# EAGLE design QiCape-v0.1 (EAGLE 6.3)
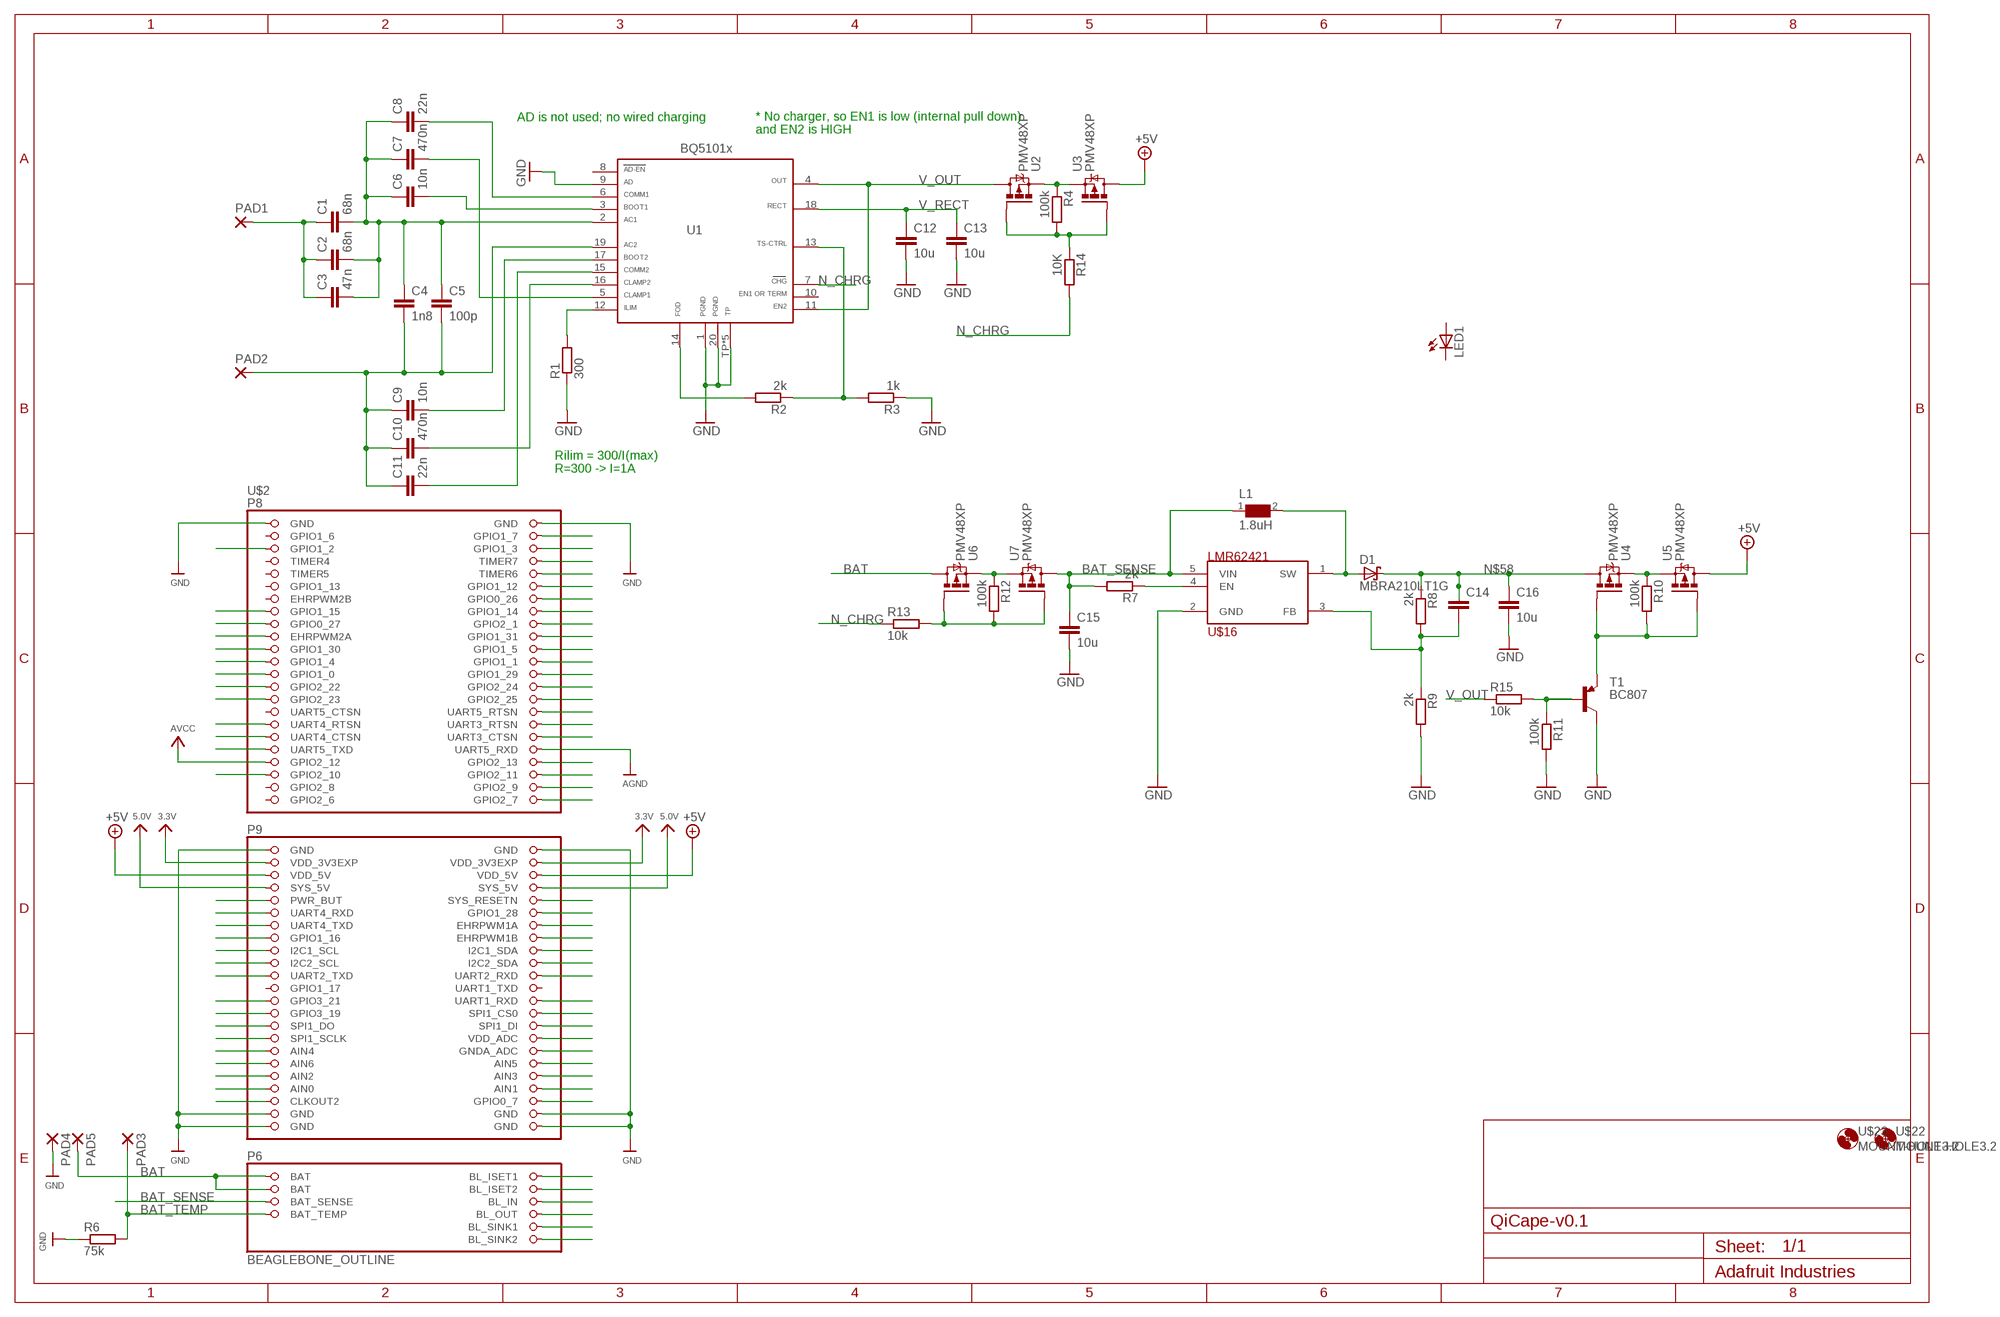
[diagram p0: schematic, sheet 1]

## Parts
C1  68n  C-EUC0603K  [C0603K]
C2  68n  C-EUC0603K  [C0603K]
C3  47n  C-EUC0603K  [C0603K]
C4  1n8  C-EUC0603K  [C0603K]
C5  100p  C-EUC0603K  [C0603K]
C6  10n  C-EUC0603K  [C0603K]
C7  470n  C-EUC0603K  [C0603K]
C8  22n  C-EUC0603K  [C0603K]
C9  10n  C-EUC0603K  [C0603K]
C10  470n  C-EUC0603K  [C0603K]
C11  22n  C-EUC0603K  [C0603K]
C12  10u  C-EUC0805  [C0805]
C13  10u  C-EUC0805  [C0805]
C14  C-EUC0402  [C0402]
C15  10u  C-EUC0805  [C0805]
C16  10u  C-EUC1206  [C1206]
D1  MBRA210LT1G  SCHOTTKY-DIODEMBRA210LT3G  [SMA-DO214AC]
L1  1.8uH  WE-TPC_5818/5828  [WE-TPC_5818/5828]
LED1  LEDCHIP-LED0603  [CHIP-LED0603]
PAD1  1,6/0,8  [1,6/0,8]
PAD2  1,6/0,8  [1,6/0,8]
PAD3  1,6/0,8  [1,6/0,8]
PAD4  1,6/0,8  [1,6/0,8]
PAD5  1,6/0,8  [1,6/0,8]
R1  300  R-EU_R0402  [R0402]
R2  2k  R-EU_R0402  [R0402]
R3  1k  R-EU_R0402  [R0402]
R4  100k  R-EU_R0402  [R0402]
R6  75k  R-EU_R0402  [R0402]
R7  2k  R-EU_R0402  [R0402]
R8  2k  R-EU_R0402  [R0402]
R9  2k  R-EU_R0402  [R0402]
R10  100k  R-EU_R0402  [R0402]
R11  100k  R-EU_R0402  [R0402]
R12  100k  R-EU_R0402  [R0402]
R13  10k  R-EU_R0402  [R0402]
R14  10K  R-EU_R0402  [R0402]
R15  10k  R-EU_R0402  [R0402]
T1  BC807  BC807-16-PNP-SOT23-BEC  [SOT23-BEC]
U1  BQ51013ARHL20  [RHL]
U2  PMV48XP  [SOT95P230X110-3N]
U3  PMV48XP  [SOT95P230X110-3N]
U4  PMV48XP  [SOT95P230X110-3N]
U5  PMV48XP  [SOT95P230X110-3N]
U6  PMV48XP  [SOT95P230X110-3N]
U7  PMV48XP  [SOT95P230X110-3N]
U$2  BEAGLEBONE_OUTLINE  [BEAGLEBONE_SHIELD_VS]
U$16  LMR62421  [SOT23-5]
U$22  MOUNT-HOLE3.2  [3,2]
U$23  MOUNT-HOLE3.2  [3,2]

## Nets
3.3V: U$2.49(VDD_3V3EXP) U$2.50(VDD_3V3EXP)
5.0V: U$2.53(SYS_5V) U$2.54(SYS_5V)
+5V: U3.3(D) U5.3(D) U$2.51(VDD_5V) U$2.52(VDD_5V)
AGND: U$2.38(UART5_RXD)
AVCC: U$2.39(GPIO2_12)
BAT: PAD5.1(P) U6.3(D) U$2.1_BAT(BAT) U$2.2_BAT(BAT)
BAT_SENSE: C15.1 L1.1 R7.2 U7.3(D) U$2.3_BAT_SENSE(BAT_SENSE) U$16.5(VIN)
BAT_TEMP: PAD3.1(P) R6.2 U$2.4_BAT_TEMP(BAT_TEMP)
GND: C12.2 C13.2 C15.2 C16.2 PAD4.1(P) R1.1 R3.1 R6.1 R9.2 R11.2 T1.C U1.1 U1.9 U1.20 U1.TP U1.TP1(TP) U1.TP2(TP) U1.TP3(TP) U1.TP4(TP) U$2.1(GND) U$2.2(GND) U$2.47(GND) U$2.48(GND) U$2.89(GND) U$2.90(GND) U$2.91(GND) U$2.92(GND) U$16.2(GND)
N$1: U$2.6_BL_ISET1(BL_ISET1)
N$2: R4.1 U2.2(S) U3.2(S)
N$3: C1.2 C2.2 C3.2 C4.1 C5.1 C6.1 C7.1 C8.1 U1.2
N$4: C6.2 U1.3
N$5: C7.2 U1.5
N$6: C8.2 U1.6
N$7: C1.1 C2.1 C3.1 PAD1.1(P)
N$8: U$2.15(GPIO1_15)
N$9: U$2.17(GPIO0_27)
N$10: U$2.19(EHRPWM2A)
N$11: U$2.21(GPIO1_30)
N$12: U$2.23(GPIO1_4)
N$13: U$2.25(GPIO1_0)
N$14: U$2.27(GPIO2_22)
N$15: U$2.29(GPIO2_23)
N$16: C4.2 C5.2 C9.1 C10.1 C11.1 PAD2.1(P) U1.19
N$17: U$2.33(UART4_RTSN)
N$18: U$2.35(UART4_CTSN)
N$19: U$2.37(UART5_TXD)
N$20: C9.2 U1.17
N$21: U$2.41(GPIO2_10)
N$22: C11.2 U1.15
N$23: C10.2 U1.16
N$24: R1.2 U1.12
N$25: R10.2 T1.E U4.1(G) U5.1(G)
N$26: R2.2 U1.14
N$27: U$2.8(TIMER7)
N$28: U$2.10(TIMER6)
N$29: U$2.12(GPIO1_12)
N$30: U$2.14(GPIO0_26)
N$31: U$2.16(GPIO1_14)
N$32: U$2.18(GPIO2_1)
N$33: U$2.20(GPIO1_31)
N$34: U$2.22(GPIO1_5)
N$35: U$2.24(GPIO1_1)
N$36: U$2.26(GPIO1_29)
N$37: U$2.28(GPIO2_24)
N$38: U$2.30(GPIO2_25)
N$39: U$2.32(UART5_RTSN)
N$40: U$2.34(UART3_RTSN)
N$41: U$2.36(UART3_CTSN)
N$42: R2.1 R3.2 U1.13
N$43: U$2.40(GPIO2_13)
N$44: U$2.42(GPIO2_11)
N$45: U$2.44(GPIO2_9)
N$46: U$2.46(GPIO2_7)
N$47: C14.2 R8.2 R9.1 U$16.3(FB)
N$48: U$2.5(GPIO1_2)
N$49: R11.1 R15.2 T1.B
N$50: U$2.4(GPIO1_7)
N$51: U$2.55(PWR_BUT)
N$52: U$2.57(UART4_RXD)
N$53: U$2.59(UART4_TXD)
N$54: U$2.61(GPIO1_16)
N$55: U$2.63(I2C1_SCL)
N$56: U$2.65(I2C2_SCL)
N$57: U$2.67(UART2_TXD)
N$58: C14.1 C16.1 D1.K(C) R8.1 U4.3(D)
N$59: U$2.71(GPIO3_21)
N$60: U$2.73(GPIO3_19)
N$61: U$2.75(SPI1_DO)
N$62: U$2.77(SPI1_SCLK)
N$63: U$2.79(AIN4)
N$64: U$2.81(AIN6)
N$65: U$2.83(AIN2)
N$66: U$2.85(AIN0)
N$67: U$2.87(CLKOUT2)
N$68: U$2.6(GPIO1_3)
N$69: U$2.88(GPIO0_7)
N$70: R7.1 U$16.4(EN)
N$71: R10.1 U4.2(S) U5.2(S)
N$72: R12.1 U6.2(S) U7.2(S)
N$73: R4.2 R14.1 U2.1(G) U3.1(G)
N$74: U$2.56(SYS_RESETN)
N$75: U$2.58(GPIO1_28)
N$76: U$2.60(EHRPWM1A)
N$77: U$2.62(EHRPWM1B)
N$78: U$2.64(I2C1_SDA)
N$79: U$2.66(I2C2_SDA)
N$80: U$2.68(UART2_RXD)
N$81: D1.A L1.2 U$16.1(SW)
N$82: U$2.72(UART1_RXD)
N$83: U$2.74(SPI1_CS0)
N$84: U$2.76(SPI1_DI)
N$85: U$2.78(VDD_ADC)
N$86: U$2.80(GNDA_ADC)
N$87: U$2.82(AIN5)
N$88: U$2.84(AIN3)
N$89: U$2.86(AIN1)
N_CHRG: R13.1 R14.2 U1.7
N_CHRG1: R12.2 R13.2 U6.1(G) U7.1(G)
V_OUT: R15.1 U1.4 U1.11 U2.3(D)
V_RECT: C12.1 C13.1 U1.18
Unconnected: LED1.A LED1.C U1.8 U1.10 U$2.5_BL_ISET2(BL_ISET2) U$2.7(TIMER4) U$2.9(TIMER5) U$2.9_BL_SINK1(BL_SINK1) U$2.10_BL_SINK2(BL_SINK2) U$2.11(GPIO1_13) U$2.13(EHRPWM2B) U$2.31(UART5_CTSN) U$2.69(GPIO1_17) U$2.70(UART1_TXD)

## Notes on the sheet
- AD is not used; no wired charging
- * No charger, so EN1 is low (internal pull down)
  and EN2 is HIGH
- Rilim = 300/I(max)
  R=300 -> I=1A

## Power pins joined to a net without a drawn wire
BL_IN: U$2.8_BL_IN(BL_IN)
BL_OUT: U$2.7_BL_OUT(BL_OUT)
GPIO1_6: U$2.3(GPIO1_6)
GPIO2_6: U$2.45(GPIO2_6)
GPIO2_8: U$2.43(GPIO2_8)

## Library data of the parts
C1 C2 = resistor:C-EU: CAPACITOR, European symbol; MF: KEMET; MPN: C0603C682K5RACTU; OC_NEWARK: 70K9097
C3 = resistor:C-EU: CAPACITOR, European symbol; MPN: C0603C473K5RACTU; OC_NEWARK: 53M7213
C4 = resistor:C-EU: CAPACITOR, European symbol; MPN: C0603C182K5RACTU; OC_NEWARK: 29T8997
C5 = resistor:C-EU: CAPACITOR, European symbol; MF: KEMET; MPN: C0603C101K5RACTU; OC_NEWARK: 72J6357
C6 C7 C9 C10 = resistor:C-EU: CAPACITOR, European symbol; OC_NEWARK: unknown
C8 C11 = resistor:C-EU: CAPACITOR, European symbol; MF: KEMET; MPN: C0603C223K5RACTU; OC_NEWARK: 03C3260
C12 C13 C15 = resistor:C-EU: CAPACITOR, European symbol; MPN: GRM21BR61E106KA73L; OC_NEWARK: 24R6339
C14 = resistor:C-EU: CAPACITOR, European symbol
C16 = resistor:C-EU: CAPACITOR, European symbol; MPN: C3216X5R0J106K
D1 = victor:SCHOTTKY-DIODE: Schottky Diode
L1 = EagleLibrary_Wuerth_Elektronik_eiSos_Version_6 (1):WE-TPC: Shielded Tiny Power Inductor WE-TPC - Extremely flat power inductor - High current capability - High reliability and perfect soldering characteristics because of integrated soldering pad - magnetically shielded -- Portable power like PDA, digital camera, PCMICA-cards and displays -- DC/DC-converter -- Recommended for switching regulator IC's from Linear Technology, National Semiconductor, Texas Instruments and Fairchild Semiconductor; MPN: 7440520018
LED1 = led:LED: LED OSRAM: - CHIPLED LG R971, LG N971, LY N971, LG Q971, LY Q971, LO R971, LY R971 LH N974, LH R974 LS Q976, LO Q976, LY Q976 LO Q996 - Hyper CHIPLED LW Q18S LB Q993, LB Q99A, LB R99A - SideLED LS A670, LO A670, LY A670, LG A670, LP A670 LB A673, LV A673, LT A673, LW A673 LH A674 LY A675 LS A676, LA A676, LO A676, LY A676, LW A676 LS A679, LY A679, LG A679 - Hyper Micro SIDELED® LS Y876, LA Y876, LO Y876, LY Y876 LT Y87S - SmartLED LW L88C, LW L88S LB L89C, LB L89S, LG L890 LS L89K, LO L89K, LY L89K LS L896, LA L896, LO L896, LY L896 - TOPLED LS T670, LO T670, LY T670, LG T670, LP T670 LSG T670, LSP T670, LSY T670, LOP T670, LYG T670 LG T671, LOG T671, LSG T671 LB T673, LV T673, LT T673, LW T673 LH T674 LS T676, LA T676, LO T676, LY T676, LB T676, LH T676, LSB T676, LW T676 LB T67C, LV T67C, LT T67C, LS T67K, LO T67K, LY T67K, LW E67C LS E67B, LA E67B, LO E67B, LY E67B, LB E67C, LV E67C, LT E67C LW T67C LS T679, LY T679, LG T679 LS T770, LO T770, LY T770, LG T770, LP T770 LB T773, LV T773, LT T773, LW T773 LH T774 LS E675, LA E675, LY E675, LS T675 LS T776, LA T776, LO T776, LY T776, LB T776 LHGB T686 LT T68C, LB T68C - Hyper Mini TOPLED® LB M676 - Mini TOPLED Santana® LG M470 LS M47K, LO M47K, LY M47K Source: http://www.osram.convergy.de LUXEON: - LUMILED® LXK2-PW12-R00, LXK2-PW12-S00, LXK2-PW14-U00, LXK2-PW14-V00 LXK2-PM12-R00, LXK2-PM12-S00, LXK2-PM14-U00 LXK2-PE12-Q00, LXK2-PE12-R00, LXK2-PE12-S00, LXK2-PE14-T00, LXK2-PE14-U00 LXK2-PB12-K00, LXK2-PB12-L00, LXK2-PB12-M00, LXK2-PB14-N00, LXK2-PB14-P00, LXK2-PB14-Q00 LXK2-PR12-L00, LXK2-PR12-M00, LXK2-PR14-Q00, LXK2-PR14-R00 LXK2-PD12-Q00, LXK2-PD12-R00, LXK2-PD12-S00 LXK2-PH12-R00, LXK2-PH12-S00 LXK2-PL12-P00, LXK2-PL12-Q00, LXK2-PL12-R00 Source: www.luxeon.com KINGBRIGHT: KA-3528ASYC Source: www.kingbright.com
PAD1-PAD5 = wirepad:1,6/0,8: THROUGH-HOLE PAD; OC_NEWARK: unknown
R1-R4 R6-R15 = resistor:R-EU_: RESISTOR, European symbol; MPN: ERJ3EKF3000V; OC_NEWARK: 65T8414
T1 = transistor:*-PNP-: PNP Transistror
U1 = bqevm_additional_ti_ics:BQ51013A: According to: http://www.ti.com/product/bq51013a; MPN: BQ51013ARHLT; OC_NEWARK: 28W5773
U2-U7 = nxp_fet:PMV48XP: P-channel Trench MOSFET; MPN: PMV48XP; OC_FARNELL: 1894743; OC_NEWARK: 55T6958; PACKAGE: SOT-3; SUPPLIER: NXP
U$2 = victor:BEAGLEBONE_OUTLINE
U$16 = victor:LMR62421
U$22 U$23 = holes:MOUNT-HOLE: MOUNTING HOLE with drill center marker

## Board
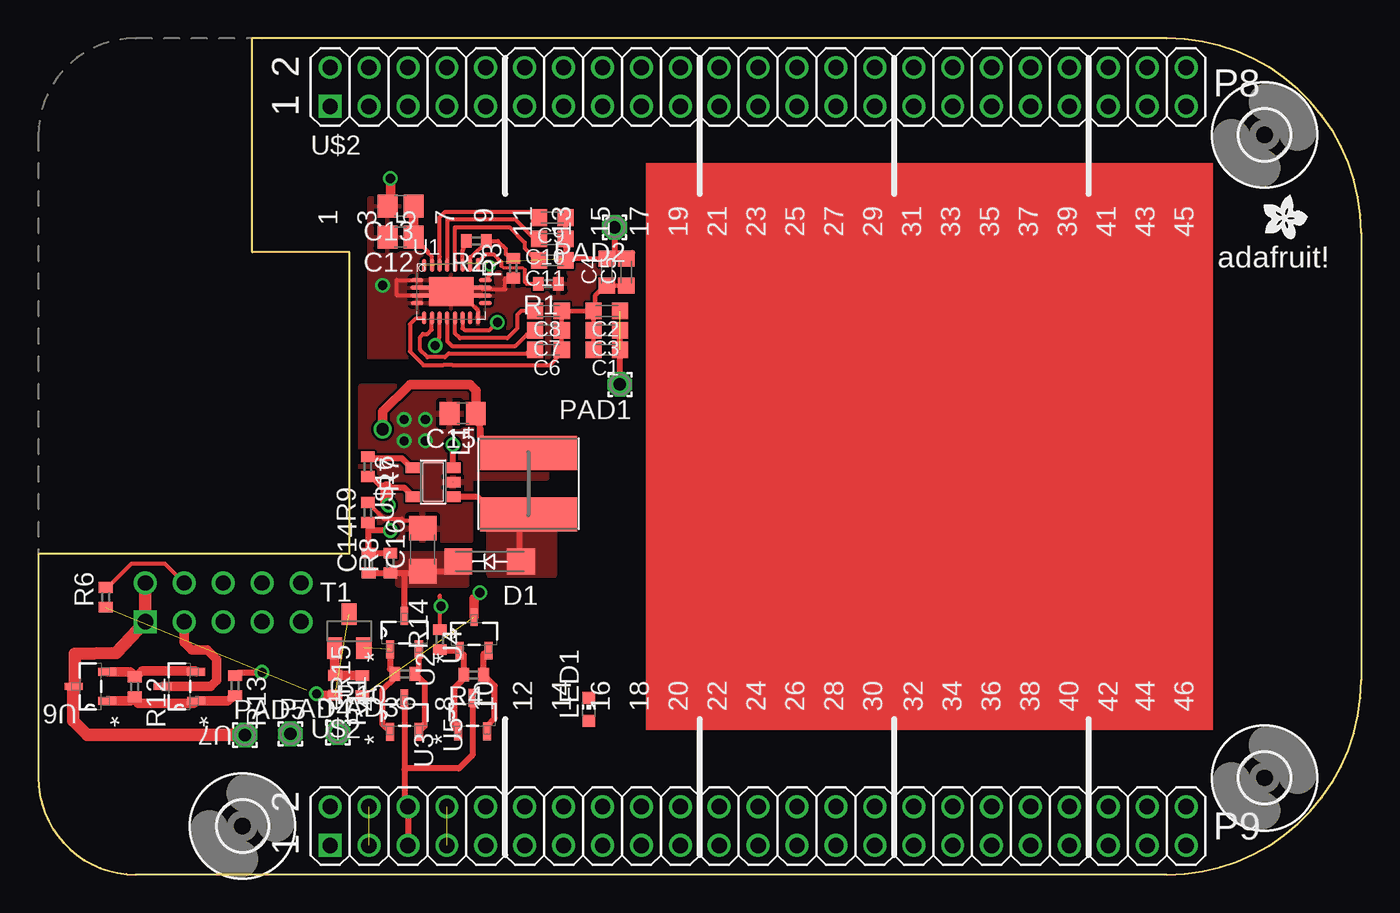
[diagram p1: board, top side]
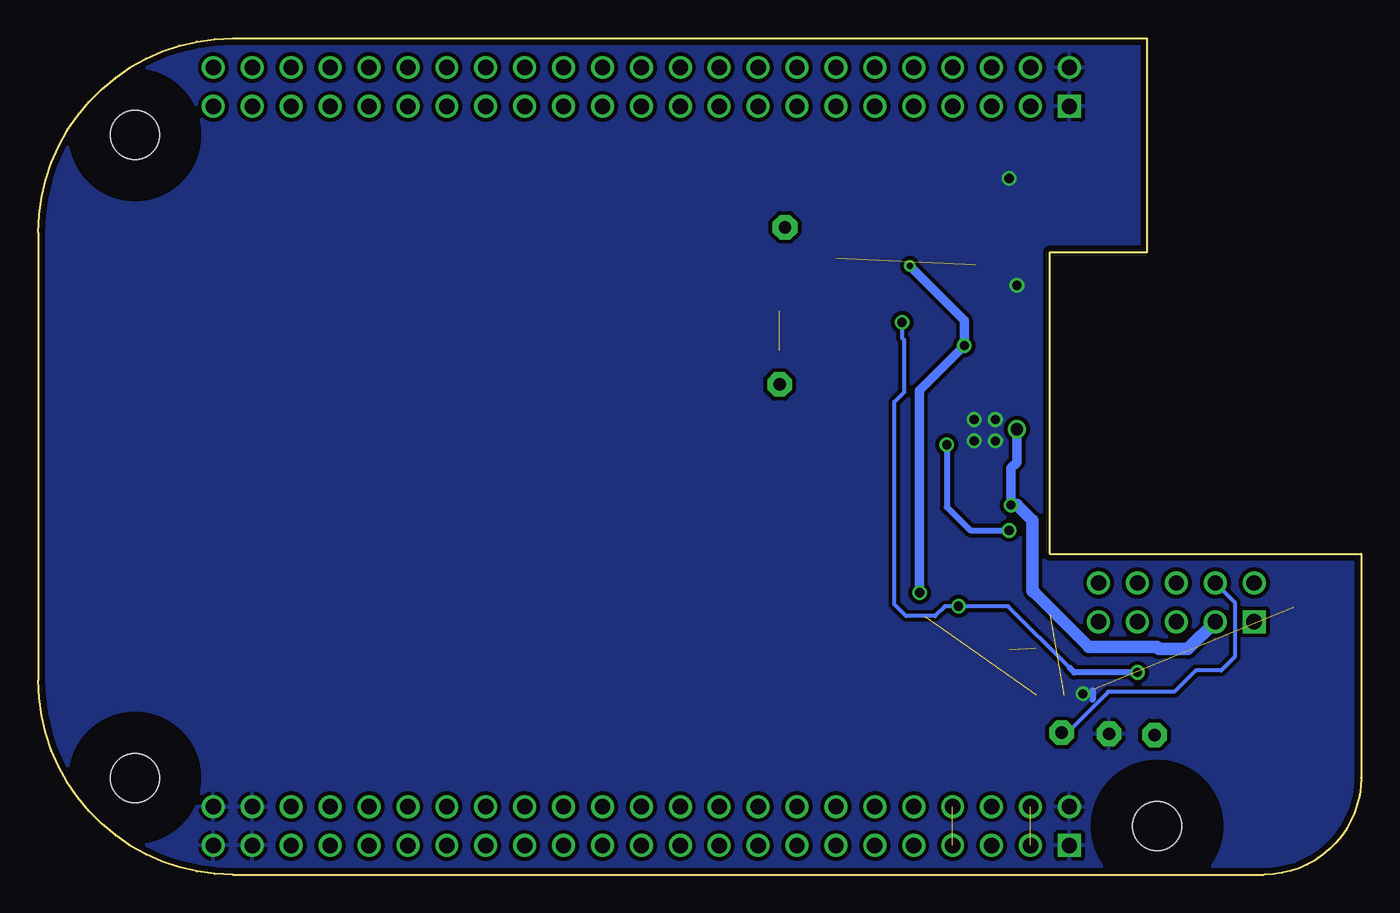
[diagram p2: board, bottom side, seen from below]

Size 86.36 x 54.61 mm. Coordinates in mm from the lower left corner, seen from the top.
Copper layers (1*16): Top 0.0356mm / dielectric 1.5011mm / Bottom 0.0356mm
Design rules "LaenPCBOrder": minimum track width 6mil, minimum drill 13mil, track to track 6mil, track to pad 6mil, pad to pad 6mil, via to via 6mil, smd to smd 6mil, copper to edge 15mil, drill to drill 6mil, minimum pad ring 7mil, minimum via ring 7mil, stop-mask expansion 4mil, vias tented up to drill 0mil, thermal gap 10mil

### Footprints (pad centres in the part's own frame; a part is rotated, then mirrored left to right if it is on the bottom)
C0603K = smd 1.05 x 1.08: 1 -0.875,0; 2 0.875,0
C0805 = smd 1.3 x 1.5: 1 -0.85,0; 2 0.85,0
C0402 = smd 0.7 x 0.9: 1 -0.65,0; 2 0.65,0
C1206 = smd 1.6 x 1.8: 1 -1.4,0; 2 1.4,0
SMA-DO214AC = smd 1.8 x 1.7: A -2.05,0; K 2.05,0
WE-TPC_5818/5828 = smd 2.2 x 6.3: 1 -2,0; 2 2.01,0
CHIP-LED0603 = smd 0.8 x 0.8: A 0,-0.75; C 0,0.75
1,6/0,8 = drill 0.813 pad 1.6 octagon: 1 0,0
R0402 = smd 0.7 x 0.9: 1 -0.65,0; 2 0.65,0
SOT23-BEC = smd 1 x 1.4: B -0.95,-1.1; C 0,1.1; E 0.95,-1.1
RHL = smd 0.85 x 0.3: 1 -2.223,-0.75; 10 2.223,-0.75; 11 2.223,0.75; 20 -2.223,0.75 | smd 0.3 x 0.85: 2 -1.75,-1.715; 3 -1.25,-1.715; 4 -0.75,-1.715; 5 -0.25,-1.715; 6 0.25,-1.715; 7 0.75,-1.715; 8 1.25,-1.715; 9 1.75,-1.715; 12 1.75,1.715; 13 1.25,1.715; 14 0.75,1.715; 15 0.25,1.715; 16 -0.25,1.715; 17 -0.75,1.715; 18 -1.25,1.715; 19 -1.75,1.715 | smd 2.9 x 1.9: TP 0,0 | smd 1.37 x 0.3: TP1 1.969,-0.25; TP2 1.969,0.25; TP3 -1.969,0.25; TP4 -1.969,-0.25
SOT95P230X110-3N = smd 1.168 x 0.533: 1 -1.092,0.94; 2 -1.092,-0.94 | smd 1.168 x 0.483: 3 1.092,0
BEAGLEBONE_SHIELD_VS = drill 1 square: 1 4.445,19.05; 1_BAT 38.1,6.985; 47 52.705,19.05 | drill 1: 2 1.905,19.05; 2_BAT 35.56,6.985; 3 4.445,21.59; 3_BAT_SENSE 38.1,9.525; 4 1.905,21.59; 4_BAT_TEMP 35.56,9.525; 5 4.445,24.13; 5_BL_ISET2 38.1,12.065; 6 1.905,24.13; 6_BL_ISET1 35.56,12.065; 7 4.445,26.67; 7_BL_OUT 38.1,14.605; 8 1.905,26.67; 8_BL_IN 35.56,14.605; 9 4.445,29.21; 9_BL_SINK1 38.1,17.145; 10 1.905,29.21; 10_BL_SINK2 35.56,17.145; 11 4.445,31.75; 12 1.905,31.75; 13 4.445,34.29; 14 1.905,34.29; 15 4.445,36.83; 16 1.905,36.83; 17 4.445,39.37; 18 1.905,39.37; 19 4.445,41.91; 20 1.905,41.91; 21 4.445,44.45; 22 1.905,44.45; 23 4.445,46.99; 24 1.905,46.99; 25 4.445,49.53; 26 1.905,49.53; 27 4.445,52.07; 28 1.905,52.07; 29 4.445,54.61; 30 1.905,54.61; 31 4.445,57.15; 32 1.905,57.15; 33 4.445,59.69; 34 1.905,59.69; 35 4.445,62.23; 36 1.905,62.23; 37 4.445,64.77; 38 1.905,64.77; 39 4.445,67.31; 40 1.905,67.31; 41 4.445,69.85; 42 1.905,69.85; 43 4.445,72.39; 44 1.905,72.39; 45 4.445,74.93; 46 1.905,74.93; 48 50.165,19.05; 49 52.705,21.59; 50 50.165,21.59; 51 52.705,24.13; 52 50.165,24.13; 53 52.705,26.67; 54 50.165,26.67; 55 52.705,29.21; 56 50.165,29.21; 57 52.705,31.75; 58 50.165,31.75; 59 52.705,34.29; 60 50.165,34.29; 61 52.705,36.83; 62 50.165,36.83; 63 52.705,39.37; 64 50.165,39.37; 65 52.705,41.91; 66 50.165,41.91; 67 52.705,44.45; 68 50.165,44.45; 69 52.705,46.99; 70 50.165,46.99; 71 52.705,49.53; 72 50.165,49.53; 73 52.705,52.07; 74 50.165,52.07; 75 52.705,54.61; 76 50.165,54.61; 77 52.705,57.15; 78 50.165,57.15; 79 52.705,59.69; 80 50.165,59.69; 81 52.705,62.23; 82 50.165,62.23; 83 52.705,64.77; 84 50.165,64.77; 85 52.705,67.31; 86 50.165,67.31; 87 52.705,69.85; 88 50.165,69.85; 89 52.705,72.39; 90 50.165,72.39; 91 52.705,74.93; 92 50.165,74.93
SOT23-5 = smd 0.69 x 0.99: 1 -0.95,-1.29; 2 0,-1.29; 3 0.95,-1.29; 4 0.95,1.3; 5 -0.95,1.3
3,2 = hole 3.2: 0,0

### Placement (x,y rotation side)
C1  37.11,34.26 180 top
C2  37.11,36.8 180 top
C3  37.11,35.53 180 top
C4  37.11,39.34 90 top
C5  38.38,39.34 90 top
C6  33.3,34.26 180 top
C7  33.3,35.53 180 top
C8  33.3,36.8 180 top
C9  33.55,42.9 180 top
C10  33.55,41.5 180 top
C11  33.55,40.11 180 top
C12  23.65,41.63 180 top
C13  23.65,43.66 180 top
C14  21.56,20.35 90 top
C15  27.71,30.12 180 top
C16  25.1,21.21 90 top
D1  29.46,20.45 180 top
L1  32,25.53 270 top
LED1  35.94,10.79 0 top
PAD1  37.97,32 180 top
PAD2  37.62,42.27 180 top
PAD3  19.56,9.27 0 top
PAD4  16.46,9.19 0 top
PAD5  13.49,9.12 0 top
R1  33.3,38.58 180 top
R2  28.6,41.38 180 top
R3  31.01,39.6 90 top
R4  28.42,13.06 180 top
R6  4.39,18.11 90 top
R7  21.51,26.64 270 top
R8  22.99,20.35 90 top
R9  21.51,23.65 90 top
R10  23.93,13.11 180 top
R11  19.38,12.37 270 top
R12  6.3,12.27 270 top
R13  12.85,12.34 270 top
R14  26.21,15.34 90 top
R15  21.16,12.34 90 top
T1  20.29,15.9 0 top
U1  26.95,38.07 0 top
U2  28.45,15.72 90 top
U3  28.35,10.44 90 top
U4  23.9,15.8 90 top
U5  23.9,10.41 90 top
U6  3.4,12.29 180 top
U7  9.22,12.29 180 top
U$2  0,54.61 270 top
U$7  [ADAFRUIT200MIL]  81.41,43.05 270 top
U$16  25.78,25.63 90 top
U$17  [3,2]  13.34,3.17 0 top
U$22  80.05,48.3 0 top
U$23  80.05,6.32 0 top

### Tracks (layer width: path | path; a pad name or v marks a point on that pad's centre or on a via)
3.3V  (1 unrouted)
5.0V  (1 unrouted)
+5V
  Top 0.406: U5.3 23.9,6.86 | 23.9,6.86 23.9,4.67 U$2.52 U$2.51 | U3.3 28.35,7.8 28.3,7.75 28.27,7.75 27.46,6.93 23.98,6.93 23.9,6.86
BAT
  Top 0.813: U$2.2_BAT U$2.1_BAT 5.08,14.48 2.36,14.43 2.36,12.34 U6.3 2.29,12.27 2.29,10.03 3.2,9.12 PAD5.1
BAT_SENSE  (via drill 0.6, 0.8)
  Top 0.254: 29.31,27.4 28.96,27.75 28.96,29.08 28.45,29.59 28.45,30.48
  Top 0.406: 29.31,27.4 29.59,27.69 29.75,27.53 29.88,27.53 | L1.1 29.88,27.53 | 29.88,27.53 28.83,28.57 28.83,29.86 C15.1 | R7.2 21.76,26 22.48,25.27 22.73,25.27 23.89,25.27 U$16.5
  Top 0.61: U7.3 11.25,12.29 11.66,12.7 11.66,14.05 11.02,14.68 10.01,14.68 9.53,15.16 U$2.3_BAT_SENSE | 28.45,30.48 28.57,30.61 28.57,31.62 28.19,32 24.26,32 22.48,30.23 v22.48,29.08
  Top 0.813: v22.86,24.13 22.73,24.26 22.73,25.27
  Bottom 0.61: v22.48,29.08 22.48,26.92 22.86,26.54 v22.86,24.13
  Bottom 0.813: U$2.3_BAT_SENSE 11.3,14.73 13.21,14.73 13.34,14.86 17.78,14.86 21.34,18.41 21.46,18.54 21.46,23.11 22.48,24.13 v22.86,24.13
BAT_TEMP
  Top 0.254: R6.2 4.54,18.76 6.1,20.32 8.26,20.32 U$2.4_BAT_TEMP
  Bottom 0.254: PAD3.1 19.18,9.27 16.51,11.94 12.19,11.94 10.79,13.34 9.14,13.34 8.26,14.22 8.26,17.78 U$2.4_BAT_TEMP
GND  (via drill 0.6)  (2 unrouted)
  Top 0.254: U1.20 24.71,38.84 23.39,38.84 23.39,37.82 23.4,37.83 U1.TP4 26.7,37.83 U1.TP | 27.2,37.83 U1.TP1 28.05,37.83 27.94,37.72 27.94,37.59 28.7,36.83 U1.9 | U1.TP2 29.02,38.23 30.48,38.23 30.48,38.92 R3.1 | R9.2 22.57,23.24 23.75,23.24 23.88,23.11 24.77,23.11 25.09,22.78 C16.2
  Top 0.61: 27.2,37.83 U1.TP | C13.2 22.99,43.85 v22.99,45.47 | R11.2 18.25,11.72 v18.16,11.81
  Bottom 0.406: 17.53,12.06 17.53,11.43
  Bottom 0.61: v22.99,45.47 22.99,45.34 | v18.16,11.81 18.29,11.81
  other vias: 22.48,38.48 23.88,29.72 25.27,29.72 25.27,28.32 23.88,28.32
  pour Top (isolate 0.15): 36.6,33.76 21.62,33.76 21.62,44.17 36.6,44.17
  pour Bottom (isolate 0.254): 13.72,54.74 75.56,54.61 83.57,51.44 86.87,43.05 86.87,7.49 81.41,2.03 77.85,0.38 75.95,-0.13 5.46,-0.38 2.03,1.27 -0.13,3.68 0.25,5.71 0.25,5.84 0,6.1 0,21.21 0.25,20.95 20.32,20.95 20.32,40.01 19.94,40.39 13.46,40.39
  pour Top: 21.08,31.88 30.61,31.88 30.61,26.67 33.15,26.67 33.15,25.91 28.19,25.91 28.19,21.84 22.23,21.84 22.23,25.91 21.08,25.91
N$2
  Top 0.406: U3.2 29.29,9.73 29.79,10.24 29.79,12.33 R4.1 29.07,14.42 U2.2
N$3
  Top 0.254: U1.2 25.15,36.31 24.62,36.31 24.26,35.94 24.26,34.16 25.15,33.27 26.42,33.27 27.05,33.27 33.4,33.27 34.17,34.05 C6.1
  Top 0.305: C2.2 C3.2 C1.2 | C2.2 C8.1 C7.1 C6.1 | C2.2 36.35,36.92 36.35,37.82 37,38.47 C4.1 C5.1
N$4
  Top 0.254: U1.3 25.68,36.34 25.68,35.59 25.4,35.31 25.12,35.31 24.93,35.12 24.93,34.26 25.4,33.78 26.54,33.78 26.8,34.04 31.88,34.04 32.11,34.27 C6.2
N$5
  Top 0.254: U1.5 26.7,34.84 27.02,34.52 31.14,34.52 31.9,35.28 32.17,35.28 C7.2
N$6
  Top 0.254: C8.2 31.52,36.8 31.27,36.55 31.27,35.66 30.63,35.03 27.52,35.03 27.2,35.34 U1.6
N$7  (2 unrouted)
  Top 0.406: PAD1.1 C3.1
N$16  (1 unrouted)
  Top 0.305: C4.2 34.29,40.22 C11.1 C10.1 C9.1
  Top 0.406: 38.77,40.62 C5.2 37.85,40.22 | 37.85,40.22 C4.2 | PAD2.1 37.62,40.45 37.85,40.22
N$20
  Top 0.254: U1.17 26.2,40.35 26.19,40.62 26.19,42.9 26.57,43.28 32.3,43.28 C9.2
N$22
  Top 0.254: U1.15 27.2,40.87 27.2,41.12 27.2,42.27 30.76,42.27 31.75,41.27 31.75,40.89 32.54,40.11 C11.2
N$23
  Top 0.254: C10.2 32.41,41.5 31.14,42.77 26.7,42.77 U1.16
N$24
  Top 0.2: 31.75,39.5 31.62,39.62 30.35,39.62 30.23,39.75
  Top 0.254: 28.7,39.77 U1.12 28.7,40.13 28.83,40.13 29.21,40.51 29.72,40.51 30.23,40.01 30.23,39.75 | 31.75,39.5 31.75,38.73 31.9,38.58 R1.2
N$25  (1 unrouted)
  Top 0.406: U4.1 22.96,13.42 R10.2 23.28,12.89 22.45,12.06 22.45,9.83 U5.1 22.94,9.34
N$26
  Top 0.254: U1.14 27.7,40.74 R2.2
N$42
  Top 0.254: U1.13 28.2,40.34 28.28,40.34 29.25,41.31 R2.1 30,41.38 30.5,40.87 30.5,40.5 R3.2
N$47  (via drill 0.6)
  Top 0.406: R8.2 C14.2 21.57,22.48 | 21.57,22.48 21.57,22.95 R9.1 | U$16.3 27.07,28.05 v27.05,28.07 | v22.99,22.48 21.57,22.48
  Bottom 0.406: v27.05,28.07 27.05,24 25.53,22.48 v22.99,22.48
N$49
  Top 0.61: T1.B 19.34,13.05 R11.1 21.13,13.02 R15.2
N$58
  Top 0.406: C16.1 25.65,19.81 | 25.65,19.81 26.78,19.81 D1.K | C14.1 R8.1 24,19.7 | 24,19.7 25.54,19.7 25.65,19.81 | U4.3 23.9,19.59 24,19.7
  pour Top (no thermals): 23.75,20.95 27.94,20.95 27.94,19.81 27.94,18.92 23.5,18.92 23.5,20.7 23.75,20.7
N$70
  Top 0.406: U$16.4 24.35,26.58 23.75,27.18 21.63,27.18 R7.1
N$71
  Top 0.406: U4.2 24.84,13.37 R10.1 24.61,13.11 25.22,12.5 25.22,9.7 U5.2
N$72
  Top 0.61: U6.2 5.98,13.23 R12.1 6.39,12.92 6.78,13.31 10.24,13.31 U7.2
N$73
  Top 0.406: R14.1 26.27,14.63 U2.1 27.77,14.37 R4.2 27.77,12.79 27.18,12.19 27.18,9.58 U3.1
N$81
  Top 0.406: D1.A 31.37,20.59 31.37,22.99 30.97,23.39 L1.2 30.84,24.3 29.08,24.26 28.66,24.68 U$16.1
  pour Top (no thermals): 29.46,24.26 33.66,24.26 33.66,20.7 33.66,19.56 29.46,19.56
N_CHRG  (via drill 0.6)
  Top 0.254: U1.7 27.69,36.35 27.69,35.69 27.81,35.56 29.46,35.56 v29.97,36.07 | v26.29,17.53 26.21,18.21 R14.2
  Top 0.406: R13.1 13.07,13.21 v14.61,13.21
  Bottom 0.254: v29.97,36.07 29.97,35.05 29.84,34.92 29.84,31.5 30.48,30.86 30.48,17.65 29.72,16.89 27.81,16.89 27.18,17.53 v26.29,17.53 23.05,17.53 19.05,13.53
  Bottom 0.406: v14.61,13.21 18.73,13.21 19.05,13.53
N_CHRG1
  Top 0.61: U6.1 6.04,11.35 R12.2 6.3,11.4 6.53,11.18 10.13,11.18 U7.1 12.36,11.35 R13.2
V_OUT  (via drill 0.4, 0.6)  (1 unrouted)
  Top 0.254: U1.4 26.16,36.32 26.16,35.05 | 26.16,34.67 26.16,35.05 | 26.16,35.05 25.91,34.8 v25.91,34.54 | U1.11 29.17,38.84 29.46,39.13 v29.46,39.75
  Top 0.61: U2.3 28.45,18.03 v28.83,18.41
  Bottom 0.254: v29.46,39.75 29.46,39.62
  Bottom 0.61: v29.46,39.75 25.91,36.2 v25.91,34.54 28.83,31.62 v28.83,18.41
V_RECT
  Top 0.254: U1.18 25.7,40.34 25.43,40.62 25.43,40.7 C12.1
  Top 0.61: C13.1 C12.1
(copper drawn outside any net)
  shapes: Top area x1

### Text on the board
tPlace: 2 | P8 | 1 | 9 | 1 | 3 | 5 | 7 | 11 | 13 | 15 | 17 | 19 | 21 | 23 | 25 | 27 | 29 | 31 | 33 | 35 | 37 | 39 | 41 | 43 | 45 | adafruit! | 2 | 4\ | 6 | 8 | 10 | 12 | 14 | 16 | 18 | 20 | 22 | 24 | 26 | 28 | 30 | 32 | 34 | 36 | 38 | 40 | 42 | 44 | 46 | 2 | P9 | 1